# Altium schematic sheet LM74910H_PINOUT.SchDoc
size C; SheetNumber: 10; SheetTotal: 12
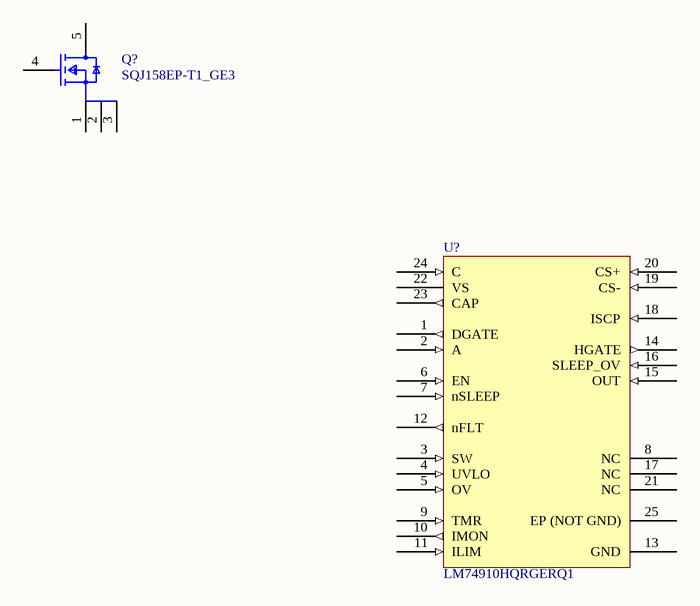
[diagram p0: LM74910H_PINOUT.SchDoc]

## Parts
Q?  SQJ158EP-T1_GE3  [FP-T16-0221-SINGLE-MFG]
U?  LM74910HQRGERQ1  [QFN50P400X400X100_HS-25N]

## Nets

Not connected (* = marked no-connect by the designer): Q? 1(S) 2(S) 3(S) 4(G) 5(D); U? 1(DGATE) 2(A) 3(SW) 4(UVLO) 5(OV) 6(EN) 7(nSLEEP) 8(NC) 9(TMR) 10(IMON) 11(ILIM) 12(nFLT) 13(GND) 14(HGATE) 15(OUT) 16(SLEEP_OV) 17(NC) 18(ISCP) 19(CS-) 20(CS+) 21(NC) 22(VS) 23(CAP) 24(C) 25(EP_(NOT_GND))

## Library data of the parts
Q? = CMP-02550-000155-1: MOSFET N-CH 60V 23A POWERPAKSO-8; Manufacturer: Vishay; Input Capacitace At Vds: 810pF @ 25V; Standoff Height: 0mm; Number Of N Channels: 1; Reverse Recovery Charge: 25nC; Power Dissipation: 45W; Pulse Drain Current: 80A; Turn Off Delay Time: 22ns; Typ Forward Diode Voltage: 0.83V; Threshold Vgs Max: 2.5V; Gate Charge At Vgs: 17nC @ 10V; Automotive Grade: Grade 0; Drain To Source Resistance: 0.0272Ω; Max Junction Temp: +175°C; Gate To Source Voltage: 20V; Threshold Vgs Min: 1.5V; Max Forward Diode Voltage: 1.2V; Turn On Delay Time: 10ns; Rthja Max: 70°C/W; Transconductance: 36S; Depletion Mode: False; Reverse Recovery Time: 25ns; Drain To Source Breakdown Voltage: 60V; RoHS: TRUE; Footprint Url: http://www.vishay.com/docs/63818/ppso8ls.pdf; Digikey Description: MOSFET N-CH 60V 23A POWERPAKSO-8; Temperature Range Low: -55°C; Temperature Range High: +175°C; Package: T16-0221-SINGLE; Height: 1.267mm; ComponentLink2URL: http://www.vishay.com/docs/75249/sqj158ep.pdf; ComponentLink2Description: Datasheet; Automotive: Yes; Device Class L2: Transistors; Continuous Drain Current: 23A; Device Class L1: Discrete Semiconductors; Device Class L3: MOSFETs; Category: Trans; Octopart: https://octopart.com/sqj158ep-t1_ge3-vishay-78440606; Drain To Source Voltage: 60V; Lead Free: Yes; Temperature: -55°C to +175°C; Number Of Channels: 1; Manufacturer Part Number: SQJ158EP-T1_GE3
U? = CMP-019-00057-1: Automotive ideal diode with circuit breaker, 200-kHz ACS, UV , OV protection and SLEEP mode 24-VQFN -40 to 125; Pins: 24; Case/Package: VQFN